# Altium schematic sheet Block Diagram.SchDoc
size A; Date: Saturday; DrawnBy: M.Fatih Agaoglu; SheetNumber: 2; SheetTotal: 2; Time: 12.11.2022
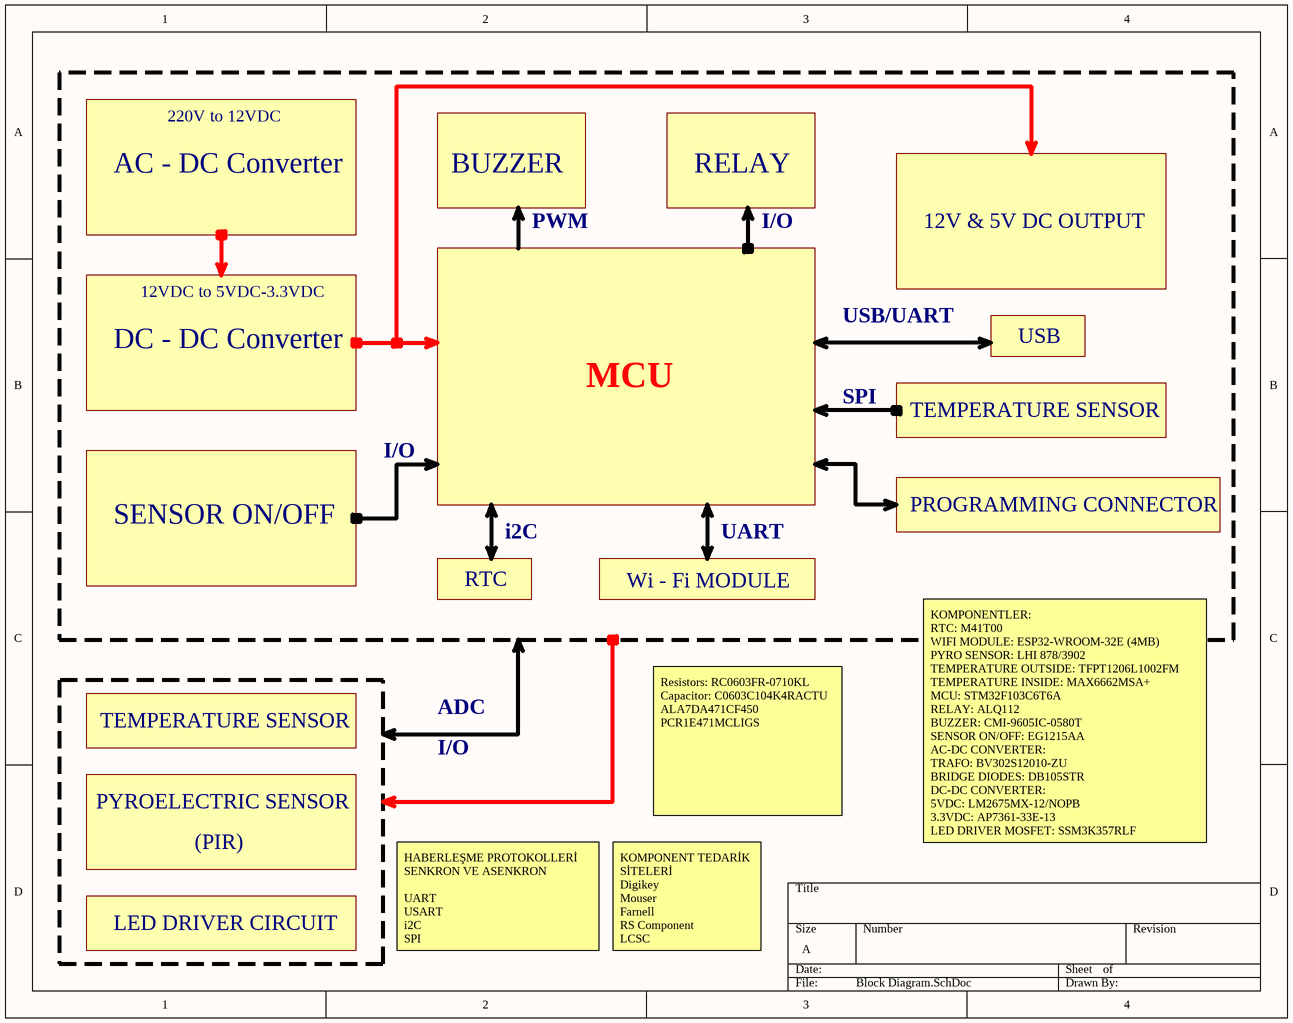
[diagram p0: Block Diagram.SchDoc]

## Notes on the sheet
- 220V to 12VDC
- AC - DC Converter
- BUZZER
- PWM
- RELAY
- I/O
- 12V & 5V DC OUTPUT
- 12VDC to 5VDC-3.3VDC
- DC - DC Converter
- USB/UART
- USB
- MCU
- SPI
- TEMPERATURE SENSOR
- SENSOR ON/OFF
- i2C
- UART
- PROGRAMMING CONNECTOR
- RTC
- Wi - Fi MODULE
- ADC
- PYROELECTRIC SENSOR
- Resistors: RC0603FR-0710KL Capacitor: C0603C104K4RACTU
  ALA7DA471CF450
  PCR1E471MCLIGS
- KOMPONENTLER:
  RTC: M41T00
  WIFI MODULE: ESP32-WROOM-32E (4MB)
  PYRO SENSOR: LHI 878/3902
  TEMPERATURE OUTSIDE: TFPT1206L1002FM
  TEMPERATURE INSIDE: MAX6662MSA+
  MCU: STM32F103C6T6A
  RELAY: ALQ112
  BUZZER: CMI-9605IC-0580T
  SENSOR ON/OFF: EG1215AA
  AC-DC CONVERTER:
  TRAFO: BV302S12010-ZU
  BRIDGE DIODES: DB105STR
  DC-DC CONVERTER:
  5VDC: LM2675MX-12/NOPB
  3.3VDC: AP7361-33E-13
  LED DRIVER MOSFET: SSM3K357RLF
- (PIR)
- LED DRIVER CIRCUIT
- HABERLEŞME PROTOKOLLERİ SENKRON VE ASENKRON
  UART
  USART
  i2C
  SPI
- KOMPONENT TEDARİK SİTELERİ
  Digikey
  Mouser
  Farnell
  RS Component
  LCSC